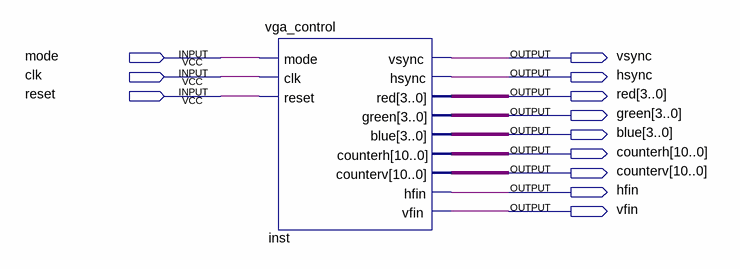
[diagram p0: schematic sheet]
// Quartus schematic Lab3.bdf as structural Verilog: 1 symbols, 12 pins
module Lab3 (
  input  mode,
  input  clk,
  input  reset,
  output vsync,
  output hsync,
  output [3:0] red,
  output [3:0] green,
  output [3:0] blue,
  output [10:0] counterh,
  output [10:0] counterv,
  output hfin,
  output vfin
);

  vga_control inst (
    .mode(mode), .clk(clk), .reset(reset), .vsync(vsync), .hsync(hsync), .red(red), .green(green),
    .blue(blue), .counterh(counterh), .counterv(counterv), .hfin(hfin), .vfin(vfin));
endmodule
